# Altium schematic sheet HDMI_CEC.SchDoc
size A4; Revision: B.2
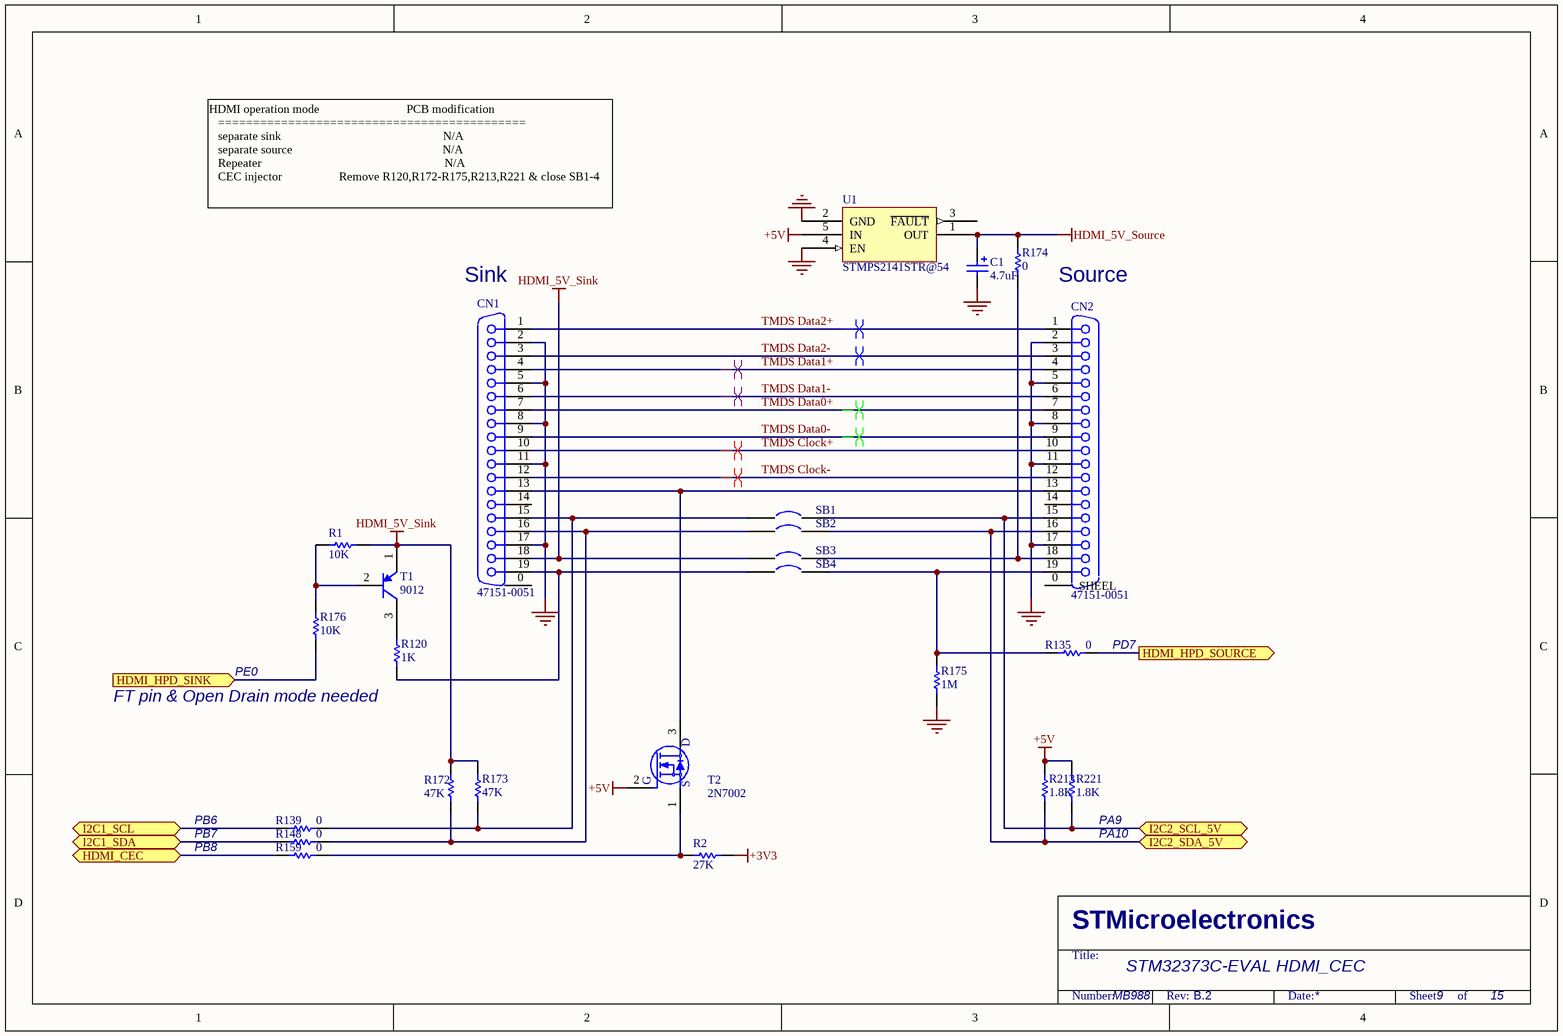
[diagram p0: HDMI_CEC.SchDoc]

## Parts
C1  4.7uF  [TAN-A]
CN1  47151-0051  [0471510051]
CN2  47151-0051  [0471510051]
R1  10K  [0603R]
R2  27K  [0603R]
R120  1K  [0603R]
R135  0  [0603R]
R139  0  [0603R]
R148  0  [0603R]
R159  0  [0603R]
R172  47K  [0603R]
R173  47K  [0603R]
R174  0  [0603R]
R175  1M  [0603R]
R176  10K  [0603R]
R213  1.8K  [0603R]
R221  1.8K  [0603R]
SB1  (no value)  [JP2_SMD]
SB2  (no value)  [JP2_SMD]
SB3  (no value)  [JP2_SMD]
SB4  (no value)  [JP2_SMD]
T1  9012  [SOT-23]
T2  2N7002  [SOT-23]
U1  STMPS2141STR@54  [SOT-23-5L]

## Ports
HDMI_CEC (bidir), HDMI_HPD_SINK (in), HDMI_HPD_SOURCE (out), I2C1_SCL (bidir), I2C1_SDA (bidir), I2C2_SCL_5V (bidir), I2C2_SDA_5V (bidir)

## Nets
+3V3: R2.2
+5V: R213.2 R221.2 T2.2(G) U1.5(IN)
GND: C1.2 CN1.2 CN1.5 CN1.8 CN1.11 CN1.17 CN2.2 CN2.5 CN2.8 CN2.11 CN2.17 R175.1 U1.2(GND) U1.4(EN)
HDMI_5V_Sink: CN1.18 R1.1 R172.2 R173.2 SB3.1 T1.1(E)
HDMI_5V_Source: C1.1 R174.1 U1.1(OUT)
HDMI_CEC: R159.2 ; port HDMI_CEC
HDMI_HPD_SINK: R176.1 ; port HDMI_HPD_SINK
HDMI_HPD_SOURCE: R135.1 ; port HDMI_HPD_SOURCE
I2C1_SCL: R139.2 ; port I2C1_SCL
I2C1_SDA: R148.2 ; port I2C1_SDA
I2C2_SCL_5V: CN2.15 R221.1 SB1.2 ; port I2C2_SCL_5V
I2C2_SDA_5V: CN2.16 R213.1 SB2.2 ; port I2C2_SDA_5V
TMDS Clock+: CN1.10 CN2.10
TMDS Clock-: CN1.12 CN2.12
TMDS Data0+: CN1.7 CN2.7
TMDS Data0-: CN1.9 CN2.9
TMDS Data1+: CN1.4 CN2.4
TMDS Data1-: CN1.6 CN2.6
TMDS Data2+: CN1.1 CN2.1
TMDS Data2-: CN1.3 CN2.3
NetCN1_13: CN1.13 CN2.13 T2.3(D)
NetCN1_15: CN1.15 R139.1 R173.1 SB1.1
NetCN1_16: CN1.16 R148.1 R172.1 SB2.1
NetCN1_19: CN1.19 R120.1 SB4.1
NetCN2_18: CN2.18 R174.2 SB3.2
NetCN2_19: CN2.19 R135.2 R175.2 SB4.2
NetR1_2: R1.2 R176.2 T1.2(B)
NetR2_1: R2.1 R159.1 T2.1(S)
NetR120_2: R120.2 T1.3(C)

Not connected (* = marked no-connect by the designer): CN1 0(SHEEL) 14; CN2 0(SHEEL) 14; U1 3(~{FAULT})

## Layout directives
differential pair: TMDS Clock+, TMDS Clock-, TMDS Data0+, TMDS Data0-, TMDS Data1+, TMDS Data1-, TMDS Data2+, TMDS Data2-

## Notes on the sheet
- HDMI operation mode                             PCB modification
  ============================================
  separate sink                                                      N/A
  separate source                                                  N/A
  Repeater                                                             N/A
  CEC injector                   Remove R120,R172-R175,R213,R221 & close SB1-4
- (near CN1) Sink
- Source
- (near R135) PD7
- (near R120) FT pin & Open Drain mode needed
- PE0
- PB8
- PB6
- PB7
- (near R221) PA9
- PA10
- STM32373C-EVAL HDMI_CEC
- MB988
- 9
- 15
- STMicroelectronics
- Title:
- Number:
- Rev:
- Date:
- Sheet       of

## Library data of the parts
C1 = Cap Pol1: Polarized Capacitor (Radial); Value: 47uF; Published: 8-Jun-2000; Revision: July-2002: Re-released for DXP Platform.; Publisher: Altium Limited
CN1 = 47151-0051(L)
CN2 = 47151-0051(R)
R1 R2 R135 R139 R148 R159 R172-R176 R213 R221 = Res1: Resistor; Value: 1K; Published: 8-Jun-2000; Revision: July-2002: Re-released for DXP Platform.; Publisher: Altium Limited
R120 = Res1: Resistor; Published: 8-Jun-2000; Revision: July-2002: Re-released for DXP Platform.; Publisher: Altium Limited; Value: 1K
SB1-SB4 = Circuit Breaker: Published: 24-Mar-1999; Revision: July-2002: Re-released for DXP Platform.; Publisher: Altium Limited
T1 = PNP: PNP Bipolar Transistor; Published: 8-Jun-2000; Revision: July-2002: Re-released for DXP Platform.; Publisher: Altium Limited; Code - JEDEC: SOT-23
U1 = STMPS2141STR